# Altium schematic sheet ASBB_FireflyX1.SchDoc
size A4
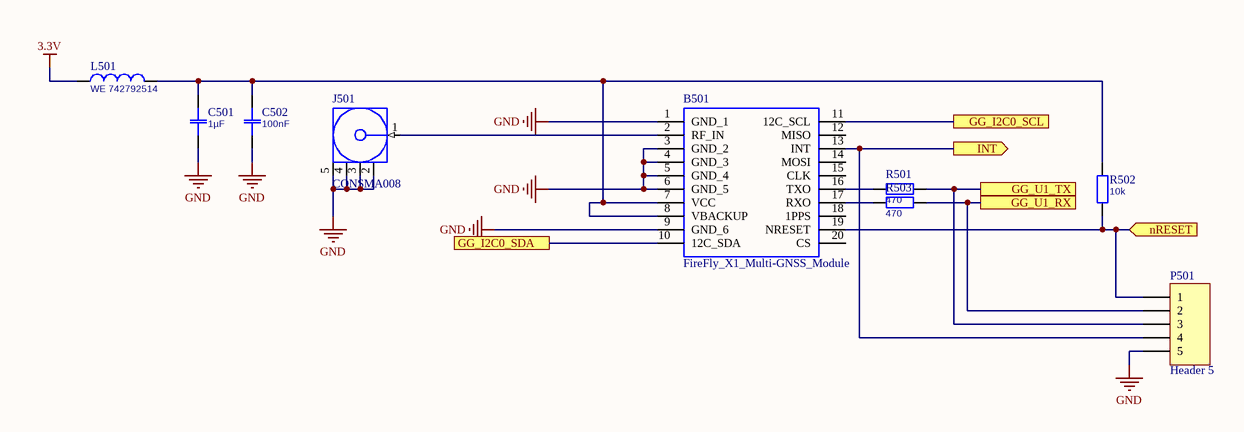
[diagram p0: ASBB_FireflyX1.SchDoc]

## Parts
B501  FireFly_X1_Multi-GNSS_Module  [X-1]
C501  1µF  [0603]
C502  100nF  [0603]
J501  CONSMA008  [CON-SMA-L]
L501  WE 742792514  [1812]
P501  Header 5  [HDR1X5]
R501  470  [0603]
R502  10k  [0603]
R503  470  [0603]

## Ports
GG_I2C0_SCL, GG_I2C0_SDA, GG_U1_RX, GG_U1_TX, INT (out), nRESET (in)

## Nets
3.3V: L501.1
GND: B501.1(GND_1) B501.3(GND_2) B501.4(GND_3) B501.5(GND_4) B501.6(GND_5) B501.9(GND_6) C501.1 C502.1 J501.2(GND) J501.3(GND) J501.4(GND) J501.5(GND) P501.5
GG_I2C0_SCL: B501.11(12C_SCL) ; port GG_I2C0_SCL
GG_I2C0_SDA: B501.10(12C_SDA) ; port GG_I2C0_SDA
GG_U1_RX: P501.2 R503.2 ; port GG_U1_RX
GG_U1_TX: P501.3 R501.2 ; port GG_U1_TX
INT: B501.13(INT) P501.4 ; port INT
nRESET: B501.19(NRESET) P501.1 R502.1 ; port nRESET
NetB501_2: B501.2(RF_IN) J501.1(Signal)
NetB501_7: B501.7(VCC) B501.8(VBACKUP) C501.2 C502.2 L501.2 R502.2
NetB501_16: B501.16(TXO) R501.1
NetB501_17: B501.17(RXO) R503.1

Not connected (* = marked no-connect by the designer): B501 12(MISO) 14(MOSI) 15(CLK) 18(1PPS) 20(CS)

## Library data of the parts
B501 = FireFly_X1_Multi-GNSS_Module: Dual system GNSS receiver Module, QFN-20; Manufacturer_Name: GlobalTop Technology Inc.; Manufacturer_Part_Number: FireFly X1 Multi-GNSS Module; RS Part Number: *; RS Price/Stock: *; Arrow Part Number: FireFly X1 Multi-GNSS Module; Arrow Price/Stock: *; Datasheet Link: http://www.gtop-tech.com/manage/upload/product/1460546926_57255.pdf
C501 C502 = Capacitor: Partnumber: ?; Value: ?
J501 = CONSMA008: SMA Female PCB Mount Connector - Extended; DatasheetVersion: revB, Feb-2010; PackageVersion: revB, Feb-2010; PackageReference: CON-SMA-L; PackageDescription: SMA Female PCB Mount Connector, Extended, Thru-Hole, 7 x 7 mm Body; ComponentLink1Description: Manufacturer URL; ComponentLink1URL: http://www.linxtechnologies.com/; ComponentLink2Description: Datasheet; ComponentLink2URL: http://www.connectorcity.com/diagrams/SMA/CONSMA008.pdf
L501 = Inductor: Partnumber: ?; Value: ?
P501 = Header 5: Header, 5-Pin; LatestRevisionDate: 17-Jul-2002; LatestRevisionNote: Re-released for DXP Platform.; Publisher: Altium Limited
R501-R503 = Resistor: Partnumber: ?; Value: ?